# Altium schematic sheet FrolfLight.SchDoc
size A
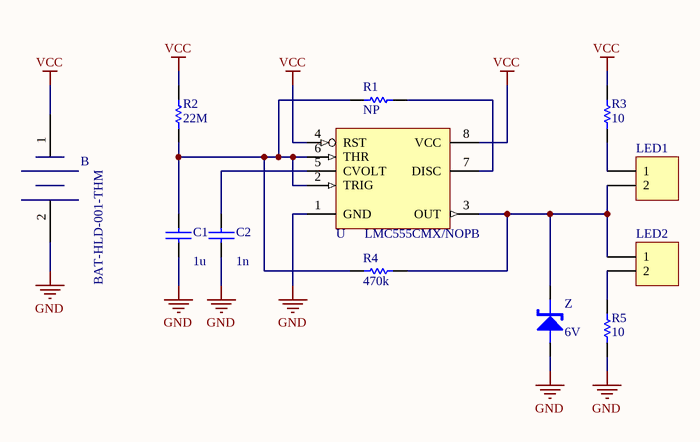
[diagram p0: FrolfLight.SchDoc]

## Parts
B  BAT-HLD-001-THM  [Batt]
C1  value 1u  [0805]
C2  value 1n  [0603]
LED1  (no value)  [HDR1X2]
LED2  (no value)  [HDR1X2]
R1  value NP  [0603]  (hidden comment: Res1)
R2  value 22M  [0603]  (hidden comment: Res1)
R3  value 10  [0603]  (hidden comment: Res1)
R4  value 470k  [0603]  (hidden comment: Res1)
R5  value 10  [0603]  (hidden comment: Res1)
U  LMC555CMX/NOPB  [555]
Z  value 6V  [SOT-23_DIODE]

## Nets
GND: B.2(-) C1.2 C2.2 R5.1 U.1(GND) Z.A
VCC: B.1(+) R2.2 R3.1 U.4(RST) U.8(VCC)
NetC1_1: C1.1 R1.1 R2.1 R4.1 U.2(TRIG) U.6(THR)
NetC2_1: C2.1 U.5(CVOLT)
NetLED1_1: LED1.1 R3.2
NetLED1_2: LED1.2 LED2.1 R4.2 U.3(OUT) Z.K
NetLED2_2: LED2.2 R5.2
NetR1_2: R1.2 U.7(DISC)

## Library data of the parts
B = Component_1
C1 C2 = CAP: Part Number: CAP; MANUFACTURER: ?
LED1 LED2 = Header 2: Header, 2-Pin; LatestRevisionDate: 17-Jul-2002; LatestRevisionNote: Re-released for DXP Platform.; Publisher: Altium Limited
R1-R5 = Res1: Resistor; Netlist: @DESIGNATOR %1 %2 @VALUE; Kind: General; PADS: 2; Part Number: Res1; Published: 8-Jun-2000; LatestRevisionDate: 17-Jul-2002; LatestRevisionNote: Re-released for DXP Platform.; Publisher: Altium Limited; Spice Prefix: R; SubKind: Resistor; MANUFACTURER: ?; Type: Resistor
U = 555
Z = DIODE, ZENER: Part Number: DIODE, ZENER; MANUFACTURER: ?